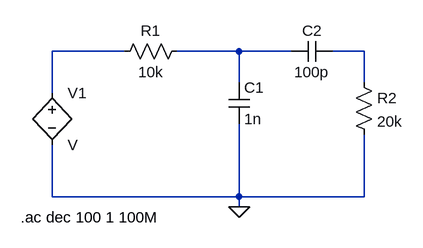
[diagram p0: schematic Primer2.asc]
Primer2.asc, the LTspice schematic file:
Version 4
SHEET 1 880 680
WIRE 48 80 -64 80
WIRE 224 80 128 80
WIRE 304 80 224 80
WIRE 416 80 368 80
WIRE 224 128 224 80
WIRE 416 128 416 80
WIRE -64 144 -64 80
WIRE -64 304 -64 224
WIRE 224 304 224 192
WIRE 224 304 -64 304
WIRE 416 304 416 208
WIRE 416 304 224 304
WIRE 224 320 224 304
FLAG 224 320 0
SYMBOL res 144 64 R90
WINDOW 0 0 56 VBottom 2
WINDOW 3 32 56 VTop 2
SYMATTR InstName R1
SYMATTR Value 10k
SYMBOL res 400 112 R0
SYMATTR InstName R2
SYMATTR Value 20k
SYMBOL cap 208 128 R0
SYMATTR InstName C1
SYMATTR Value 1n
SYMBOL cap 368 64 R90
WINDOW 0 0 32 VBottom 2
WINDOW 3 32 32 VTop 2
SYMATTR InstName C2
SYMATTR Value 100p
SYMBOL bv -64 128 R0
SYMATTR InstName V1
SYMATTR Value V
SYMATTR Prefix ""
TEXT -112 336 Left 2 !.ac dec 100 1 100M

The netlist it stands for:
* Primer2.asc
R1 N002 N001 10k
R2 N003 0 20k
C1 N002 0 1n
C2 N003 N002 100p
XV1 N001 0 V  ; pins + -
.ac dec 100 1 100M
.backanno
.end